# Altium schematic sheet GateDriver.SchDoc
size A4; SheetNumber: 2; SheetTotal: 3
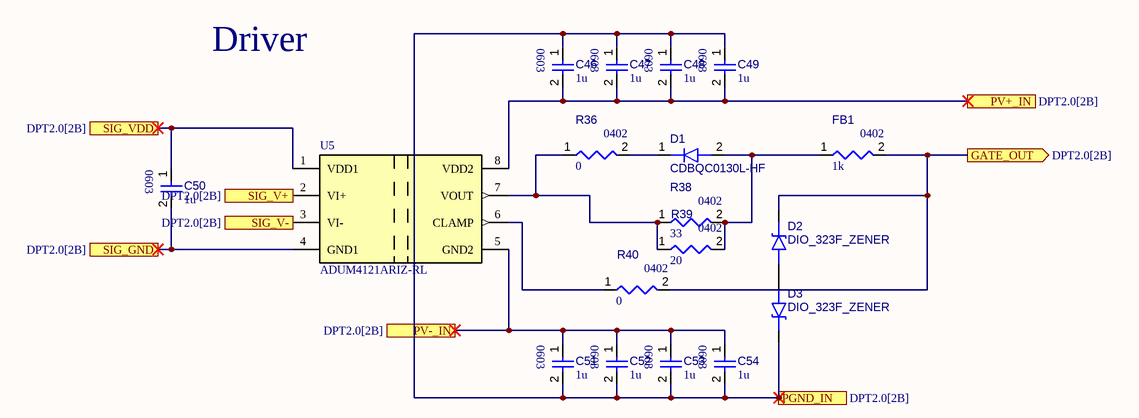
[diagram p0: GateDriver.SchDoc]

## Parts
C46  value 1u  [CAP_0603_HIGH]  (hidden comment: CAP-0603)
C47  value 1u  [CAP_0603_HIGH]  (hidden comment: CAP-0603)
C48  value 1u  [CAP_0603_HIGH]  (hidden comment: CAP-0603)
C49  value 1u  [CAP_0603_HIGH]  (hidden comment: CAP-0603)
C50  value 1u  [CAP_0603_HIGH]  (hidden comment: CAP-0603)
C51  value 1u  [CAP_0603_HIGH]  (hidden comment: CAP-0603)
C52  value 1u  [CAP_0603_HIGH]  (hidden comment: CAP-0603)
C53  value 1u  [CAP_0603_HIGH]  (hidden comment: CAP-0603)
C54  value 1u  [CAP_0603_HIGH]  (hidden comment: CAP-0603)
D1  CDBQC0130L-HF  [DIO_SOD-923F]
D2  DIO_323F_ZENER  [DIO_SOD-323F]
D3  DIO_323F_ZENER  [DIO_SOD-323F]
FB1  value 1k  [RES_0402_HIGH]  (hidden comment: RES-0402)
R36  value 0  [RES_0402_HIGH]  (hidden comment: RES-0402)
R38  value 33  [RES_0402_HIGH]  (hidden comment: RES-0402)
R39  value 20  [RES_0402_HIGH]  (hidden comment: RES-0402)
R40  value 0  [RES_0402_HIGH]  (hidden comment: RES-0402)
U5  ADUM4121ARIZ-RL  [SOIC-8_WIDE]

## Ports
GATE_OUT (out, see DPT2.0[2B]), PGND_IN (see DPT2.0[2B]), PV+_IN (see DPT2.0[2B]), PV-_IN (see DPT2.0[2B]), SIG_GND (see DPT2.0[2B]), SIG_V+ (in, see DPT2.0[2B]), SIG_V- (in, see DPT2.0[2B]), SIG_VDD (see DPT2.0[2B])

## Nets
GATE_OUT: D2.1(K) FB1.2 R40.2 ; port GATE_OUT
PGND_IN: C46.1 C47.1 C48.1 C49.1 C51.2 C52.2 C53.2 C54.2 D3.1(K) ; port PGND_IN
PV+_IN: C46.2 C47.2 C48.2 C49.2 U5.8(VDD2) ; port PV+_IN
PV-_IN: C51.1 C52.1 C53.1 C54.1 U5.5(GND2) ; port PV-_IN
SIG_GND: C50.2 U5.4(GND1) ; port SIG_GND
SIG_V+: U5.2(VI+) ; port SIG_V+
SIG_V-: U5.3(VI-) ; port SIG_V-
SIG_VDD: C50.1 U5.1(VDD1) ; port SIG_VDD
NetD1_1: D1.1(K) R36.2
NetD1_2: D1.2(A) FB1.1 R38.2 R39.2
NetD2_2: D2.2(A) D3.2(A)
NetR36_1: R36.1 R38.1 R39.1 U5.7(VOUT)
NetR40_1: R40.1 U5.6(CLAMP)

## Notes on the sheet
- Driver

## Library data of the parts
C46-C54 = CMP-001-00084-2: Non polarized SMD capacitor - 0603 (1608 Metric); Package: 0603
D1 = CMP-004-00031-2: Low VF SMD Schottky Barrier Diode; Package: SOD-923F
D2 D3 = CMP-004-00032-1: Generic SOD-323F Zener diode; Value: 6.2V; Package: SOD-323F
FB1 R36 R38-R40 = CMP-009-00177-2: SMD Resistor - 0402 (1005 Metric); Package: 0402
U5 = CMP-019-000000-5: DGTL ISO 5KV 1CH GATE DRVR 8SOIC; Package: 8-SOIC WIDE